# Altium project Near H-Filed-Probe.PrjPcb
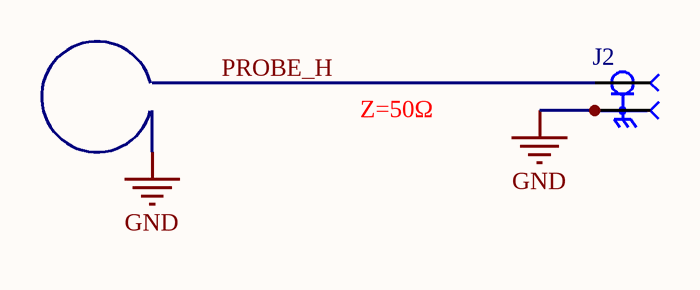
[diagram p0: H-field-Near-Field-probe.SchDoc]
1 sheet, 1 parts. Net scope: global (net labels, ports and power ports of the same name join across sheets).
Board files: Near-H-Field-Probe - Mi-tai logo.PcbDoc, Near-H-Field-Probe.PcbDoc

## Sheet H-field-Near-Field-probe.SchDoc: Near-H_Field-Probe
size A4; Author: Ravi Kumar Dusi; SheetNumber: 1; SheetTotal: 1

### Parts
J2  (no value)  [RFSOLUTIONS_CON-SMA-EDGE-S]

### Nets
GND: J2.G1 J2.G2 J2.G3 J2.G4
PROBE_H: J2.1

### Notes on the sheet
- Z=50Ω
- TITLE:
- DOCUMENT NAME:
- AUTHOR :
- REVIEWER:
- This document is created for Mitai. Any further questions can be asked through teams@mitai.ai
- Sheet
- PART NO.:
- of
- DATE:
- *
- TEMPLATE:
- A4
- Contact Address:Rosenheimer Straße 116b,81669, München.

### Library data of the parts
J2 = CON-SMA-EDGE-S: SMA Connector Jack, Female Socket - Board Edge, End Launch Solder; MF: RF Solutions; Value: *; SnapEDA_Link: https://www.snapeda.com/parts/CON-SMA-EDGE-S/RF+Solutions/view-part/?ref=snap; Purchase-URL: https://pricing.snapeda.com/search/part/CON-SMA-EDGE-S/?ref=eda; Check_prices: https://www.snapeda.com/parts/CON-SMA-EDGE-S/RF+Solutions/view-part/?ref=eda; Digi-Key_Part_Number: CON-SMA-EDGE-S-ND; Package: None; MP: CON-SMA-EDGE-S